# EAGLE schematic 20W-IR-Blaster_Simplified (EAGLE 9.6.2)
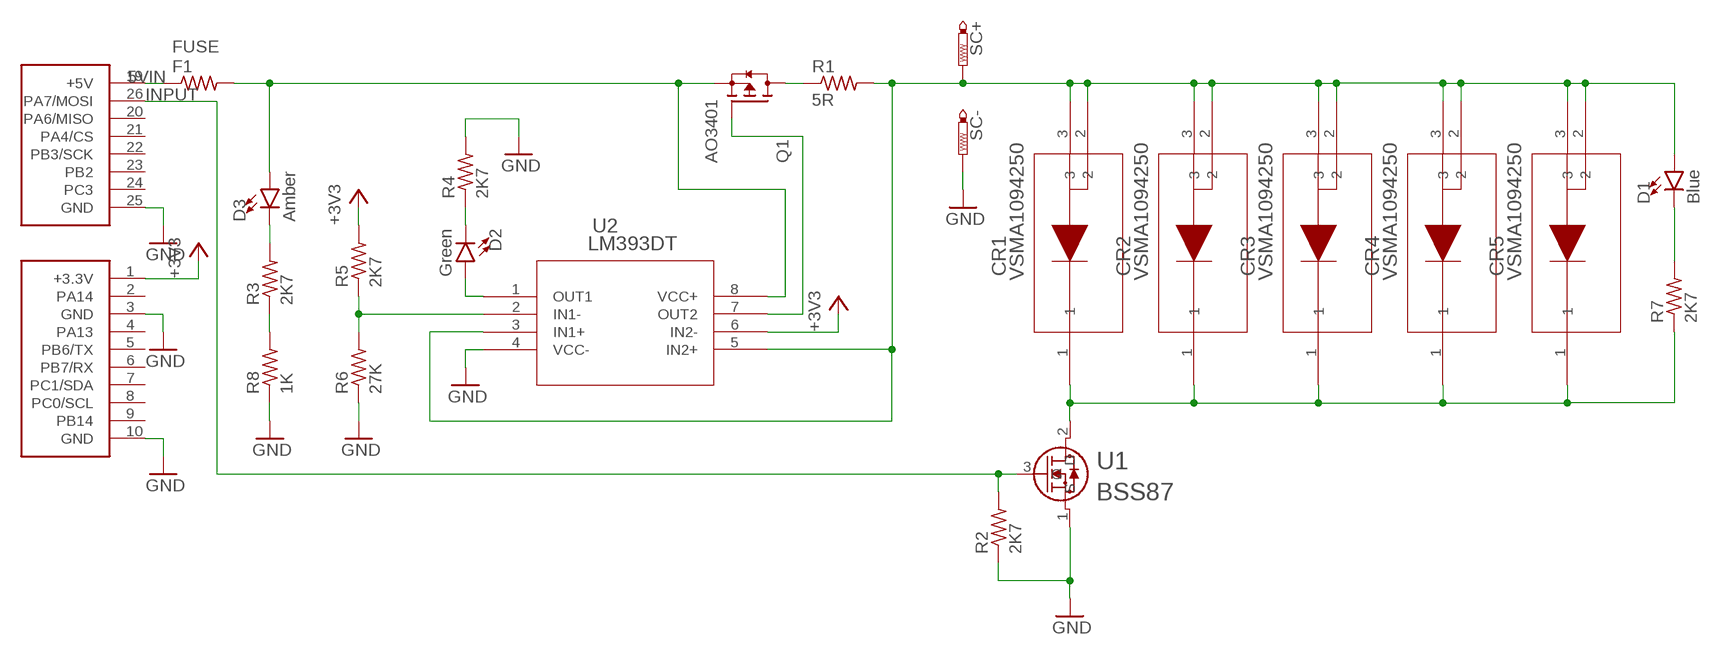
[diagram p0: schematic, sheet 1]

## Parts
CR1  VSMA1094250  [DIODE_VSMA1094250_VIS]
CR2  VSMA1094250  [DIODE_VSMA1094250_VIS]
CR3  VSMA1094250  [DIODE_VSMA1094250_VIS]
CR4  VSMA1094250  [DIODE_VSMA1094250_VIS]
CR5  VSMA1094250  [DIODE_VSMA1094250_VIS]
D1  Blue  LED-BLUE1206  [LED-1206]
D2  Green  LED-GREEN1206  [LED-1206]
D3  Amber  LED-RED1206  [LED-1206]
F1  FUSE  R-US_R1206  [R1206]
Q1  AO3401  [AO3401]
R1  5R  R-US_R2512  [R2512]
R2  2K7  R-US_R0805  [R0805]
R3  2K7  R-US_R0805  [R0805]
R4  2K7  R-US_R0805  [R0805]
R5  2K7  R-US_R0805  [R0805]
R6  27K  R-US_R0805  [R0805]
R7  2K7  R-US_R0805  [R0805]
R8  1K  R-US_R0805  [R0805]
SC+  PTR1PAD1-20Y  [P1-20Y]
SC-  PTR1PAD1-20Y  [P1-20Y]
U1  BSS87  [SOT89_NXP]
U2  LM393DT  [SO8_STM]
U$1  BOTH-SMD  [BOTH-SMD]

## Nets
5VIN: F1.1 U$1.19(+5V)
+3V3: R5.2 U2.6(IN2-) U$1.1(+3.3V)
GND: R2.1 R4.2 R6.1 R8.1 SC-.TP U1.1(S) U2.4(VCC-) U$1.3(GND) U$1.10(GND) U$1.25(GND)
INPUT: R2.2 U1.3(G) U$1.26(PA7/MOSI)
N$1: Q1.3(D) R1.1
N$2: CR1.2 CR1.3 CR2.2 CR2.3 CR3.2 CR3.3 CR4.2 CR4.3 CR5.2 CR5.3 D1.A R1.2 SC+.TP U2.3(IN1+) U2.5(IN2+)
N$3: D2.A U2.1(OUT1)
N$4: R5.1 R6.2 U2.2(IN1-)
N$5: Q1.1(G) U2.7(OUT2)
N$6: D2.C R4.1
N$7: D1.C R7.2
N$8: D3.C R3.2
N$9: R3.1 R8.2
N$11: D3.A F1.2 Q1.2(S) U2.8(VCC+)
N$13: CR1.1 CR2.1 CR3.1 CR4.1 CR5.1 R7.1 U1.2(D)
Unconnected: U$1.2(PA14) U$1.4(PA13) U$1.5(PB6/TX) U$1.6(PB7/RX) U$1.7(PC1/SDA) U$1.8(PC0/SCL) U$1.9(PB14) U$1.20(PA6/MISO) U$1.21(PA4/CS) U$1.22(PB3/SCK) U$1.23(PB2) U$1.24(PC3)

## Library data of the parts
CR1-CR5 = VSMA1094250:VSMA1094250; COPYRIGHT: Copyright (C) 2025 Ultra Librarian. All rights reserved.; MANUFACTURER_PART_NUMBER: VSMA1094250; MFR_NAME: Vishay
D1 = SparkFun-LED:LED-BLUE: Blue SMD LED Used in manufacturing of various products at SparkFun Packages: 0603 - SMD 0603 package [Product Link] <http://www.digikey.com/product-detail/en/SMLE12BC7TT86/511-1589-2-ND/1641808> 1206 - SMD1206 package [Product Link] <http://www.digikey.com/product-detail/en/lite-on-inc/LTST-C150TBKT/160-1643-1-ND/573584> SparkFun Products: ESP8266 Thing-Dev Board <https://www.sparkfun.com/products/13711> RedBoard <https://www.sparkfun.com/products/12757>; PROD_ID: DIO-09911
D2 = SparkFun-LED:LED-GREEN: Green SMD LED Used in manufacturing of various products at SparkFun Packages: 0603 - SMD 0603 package [Product Link] <http://www.futureelectronics.com/en/technologies/semiconductors/optoelectronics/leds/Pages/9894312-LTST-C190GKT.aspx?CrossPart=HSMG-C190&IM=0> LilyPad 1206 - SMD1206 LilyPad package [Product Link] <http://www.futureelectronics.com/en/Technologies/Product.aspx?ProductID=IN150NGHARVATEKCORPORATION2049943&IM=0> 1206 - SMD1206 package [Product Link] <http://www.futureelectronics.com/en/technologies/semiconductors/optoelectronics/leds/Pages/8315665-LTST-C150KGKT.aspx?IM=0> 1206 Bottom Mount -SMD 1206 Bottom Mount [Product Link] <http://www.digikey.com/product-detail/en/lite-on-inc/LTST-C230KGKT/160-1456-1-ND/386854> SparkFun Products: Pro Mini 328 -5V <https://www.sparkfun.com/products/821> RedBoard <https://www.sparkfun.com/products/12757> MP3 Trigger <https://www.sparkfun.com/products/13720> Makey Makey <https://www.sparkfun.com/products/11076>; PROD_ID: DIO-00862
D3 = SparkFun-LED:LED-RED: Red SMD LED Used in manufacturing of most products at SparkFun Packages: 0603 - KB - KingBright (DIO-17976) SMD 0603 package [Datasheet] <https://www.kingbrightusa.com/images/catalog/SPEC/APT1608SURCK.pdf> 0603 - (DIO-00819, has gone EOL) SMD 0603 package 0603 SMART - SMD 0603 SMART package ( more efficient and expensive)[Product Link] <http://www.osram-os.com/Graphics/XPic2/00077099_0.pdf> 1206 - SMD1206 package [Product Link] <https://www.sparkfun.com/datasheets/DevTools/LilyPad/Q150OVS4.pdff> SparkFun Products: Pro Mini 328 -5V <https://www.sparkfun.com/products/821> RedBoard <https://www.sparkfun.com/products/12757> IOIO-OTG <https://www.sparkfun.com/products/13613>; PROD_ID: DIO-09912; VALUE: Red
F1 R1-R8 = rcl:R-US_: RESISTOR, American symbol; SPICEPREFIX: R
Q1 = DMG2305UX-7:AO3401: DMG2305UX Series 20 V 65 Ohms P-Ch Enhancement Mode Mosfet - SOT-23-3; MANUFACTURER: Diodes Inc.; MAXIMUM_PACKAGE_HEIGHT: 1.1mm; PARTREV: 09/2018; STANDARD: IPC-7351B
SC+ SC- = testpad:PTR1: TEST PIN
U1 = AP4438:BSS87; COPYRIGHT: Copyright (C) 2025 Ultra Librarian. All rights reserved.; DIGIKEY_PART_NUMBER_1: 568-6228-2-ND; DIGIKEY_PART_NUMBER_2: 568-6228-1-ND; DIGIKEY_PART_NUMBER_3: 568-6228-6-ND; DIGIKEY_PART_NUMBER_4: BSS87INTR-ND; MANUFACTURER_PART_NUMBER: BSS87; MFR_NAME: NXP
U2 = LM393DTR:LM393DT; COPYRIGHT: Copyright (C) 2025 Ultra Librarian. All rights reserved.; MANUFACTURER_PART_NUMBER: LM393DT; MFR_NAME: STMicroelectronics
U$1 = Flipper-Zero-GPIO-Headers:BOTH-SMD